# Altium schematic sheet Receptor D.SchDoc
size A4
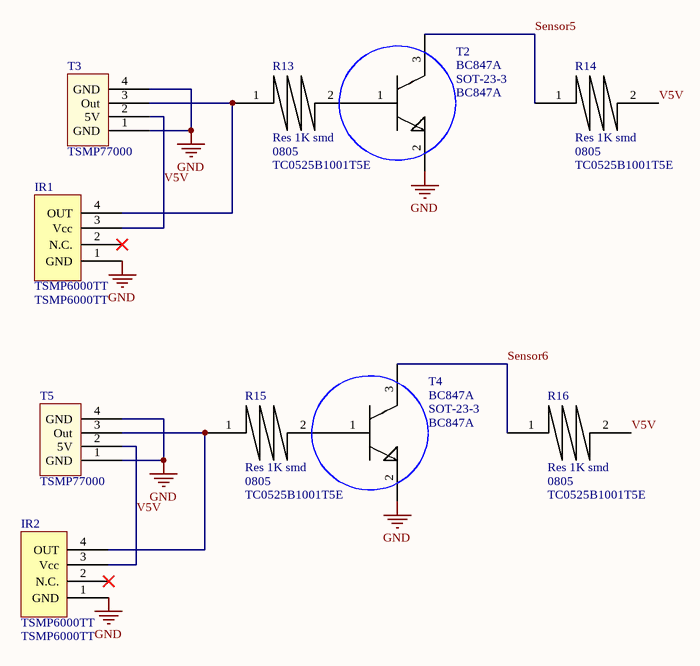
[diagram p0: Receptor D.SchDoc]

## Parts
IR1  TSMP6000TT  [TSMP6000TT]
IR2  TSMP6000TT  [TSMP6000TT]
R13  Res 1K smd  Package: 0805  MFR.Part #: TC0525B1001T5E  [RES 1K]
R14  Res 1K smd  Package: 0805  MFR.Part #: TC0525B1001T5E  [RES 1K]
R15  Res 1K smd  Package: 0805  MFR.Part #: TC0525B1001T5E  [RES 1K]
R16  Res 1K smd  Package: 0805  MFR.Part #: TC0525B1001T5E  [RES 1K]
T2  BC847A  Package: SOT-23-3  [BC847A]
T3  TSMP77000  [TSMP77000]
T4  BC847A  Package: SOT-23-3  [BC847A]
T5  TSMP77000  [TSMP77000]

## Nets
GND: IR1.1(GND) IR2.1(GND) T2.2 T3.1(GND) T3.4(GND) T4.2 T5.1(GND) T5.4(GND)
Sensor5: R14.1 T2.3
Sensor6: R16.1 T4.3
V5V: IR1.3(Vcc) IR2.3(Vcc) R14.2 R16.2 T3.2(5V) T5.2(5V)
NetIR1_4: IR1.4(OUT) R13.1 T3.3(Out)
NetIR2_4: IR2.4(OUT) R15.1 T5.3(Out)
NetR13_2: R13.2 T2.1
NetR15_2: R15.2 T4.1

Not connected (* = marked no-connect by the designer): IR1 2(N.C.)*; IR2 2(N.C.)*

## Library data of the parts
IR1 IR2 = TSMP6000TT: Mouser: https://www.mouser.mx/ProductDetail/Vishay-Semiconductors/TSMP6000TT?qs=N%2FGwOzoYEAATz68ZRXkk4Q%3D%3D; DGK: https://www.digikey.com.mx/es/products/detail/vishay-semiconductor-opto-division/TSMP6000TT/4696166; Part: TSMP6000TT
T2 T4 = BC847A: MFR.Part #: BC847A
T3 T5 = TSMP77000: # Parte: TSMP77000; Link: https://www.mouser.mx/datasheet/2/427/VISH_S_A0012397601_1-2572564.pdf